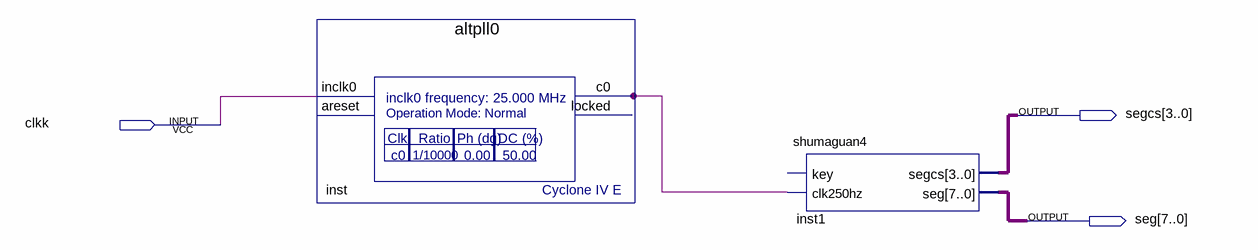
[diagram p0: schematic sheet]
// Quartus schematic smg.bdf as structural Verilog: 2 symbols, 3 pins
module smg (
  input  clkk,
  output [3:0] segcs,
  output [7:0] seg
);

  wire inst_c0;

  altpll0 inst (.inclk0(clkk), .c0(inst_c0));  // open: areset, locked
  shumaguan4 inst1 (.clk250hz(inst_c0), .segcs(segcs), .seg(seg));  // open: key
endmodule
